# Altium schematic sheet P09 CONNECT & LED.SchDoc
size A2
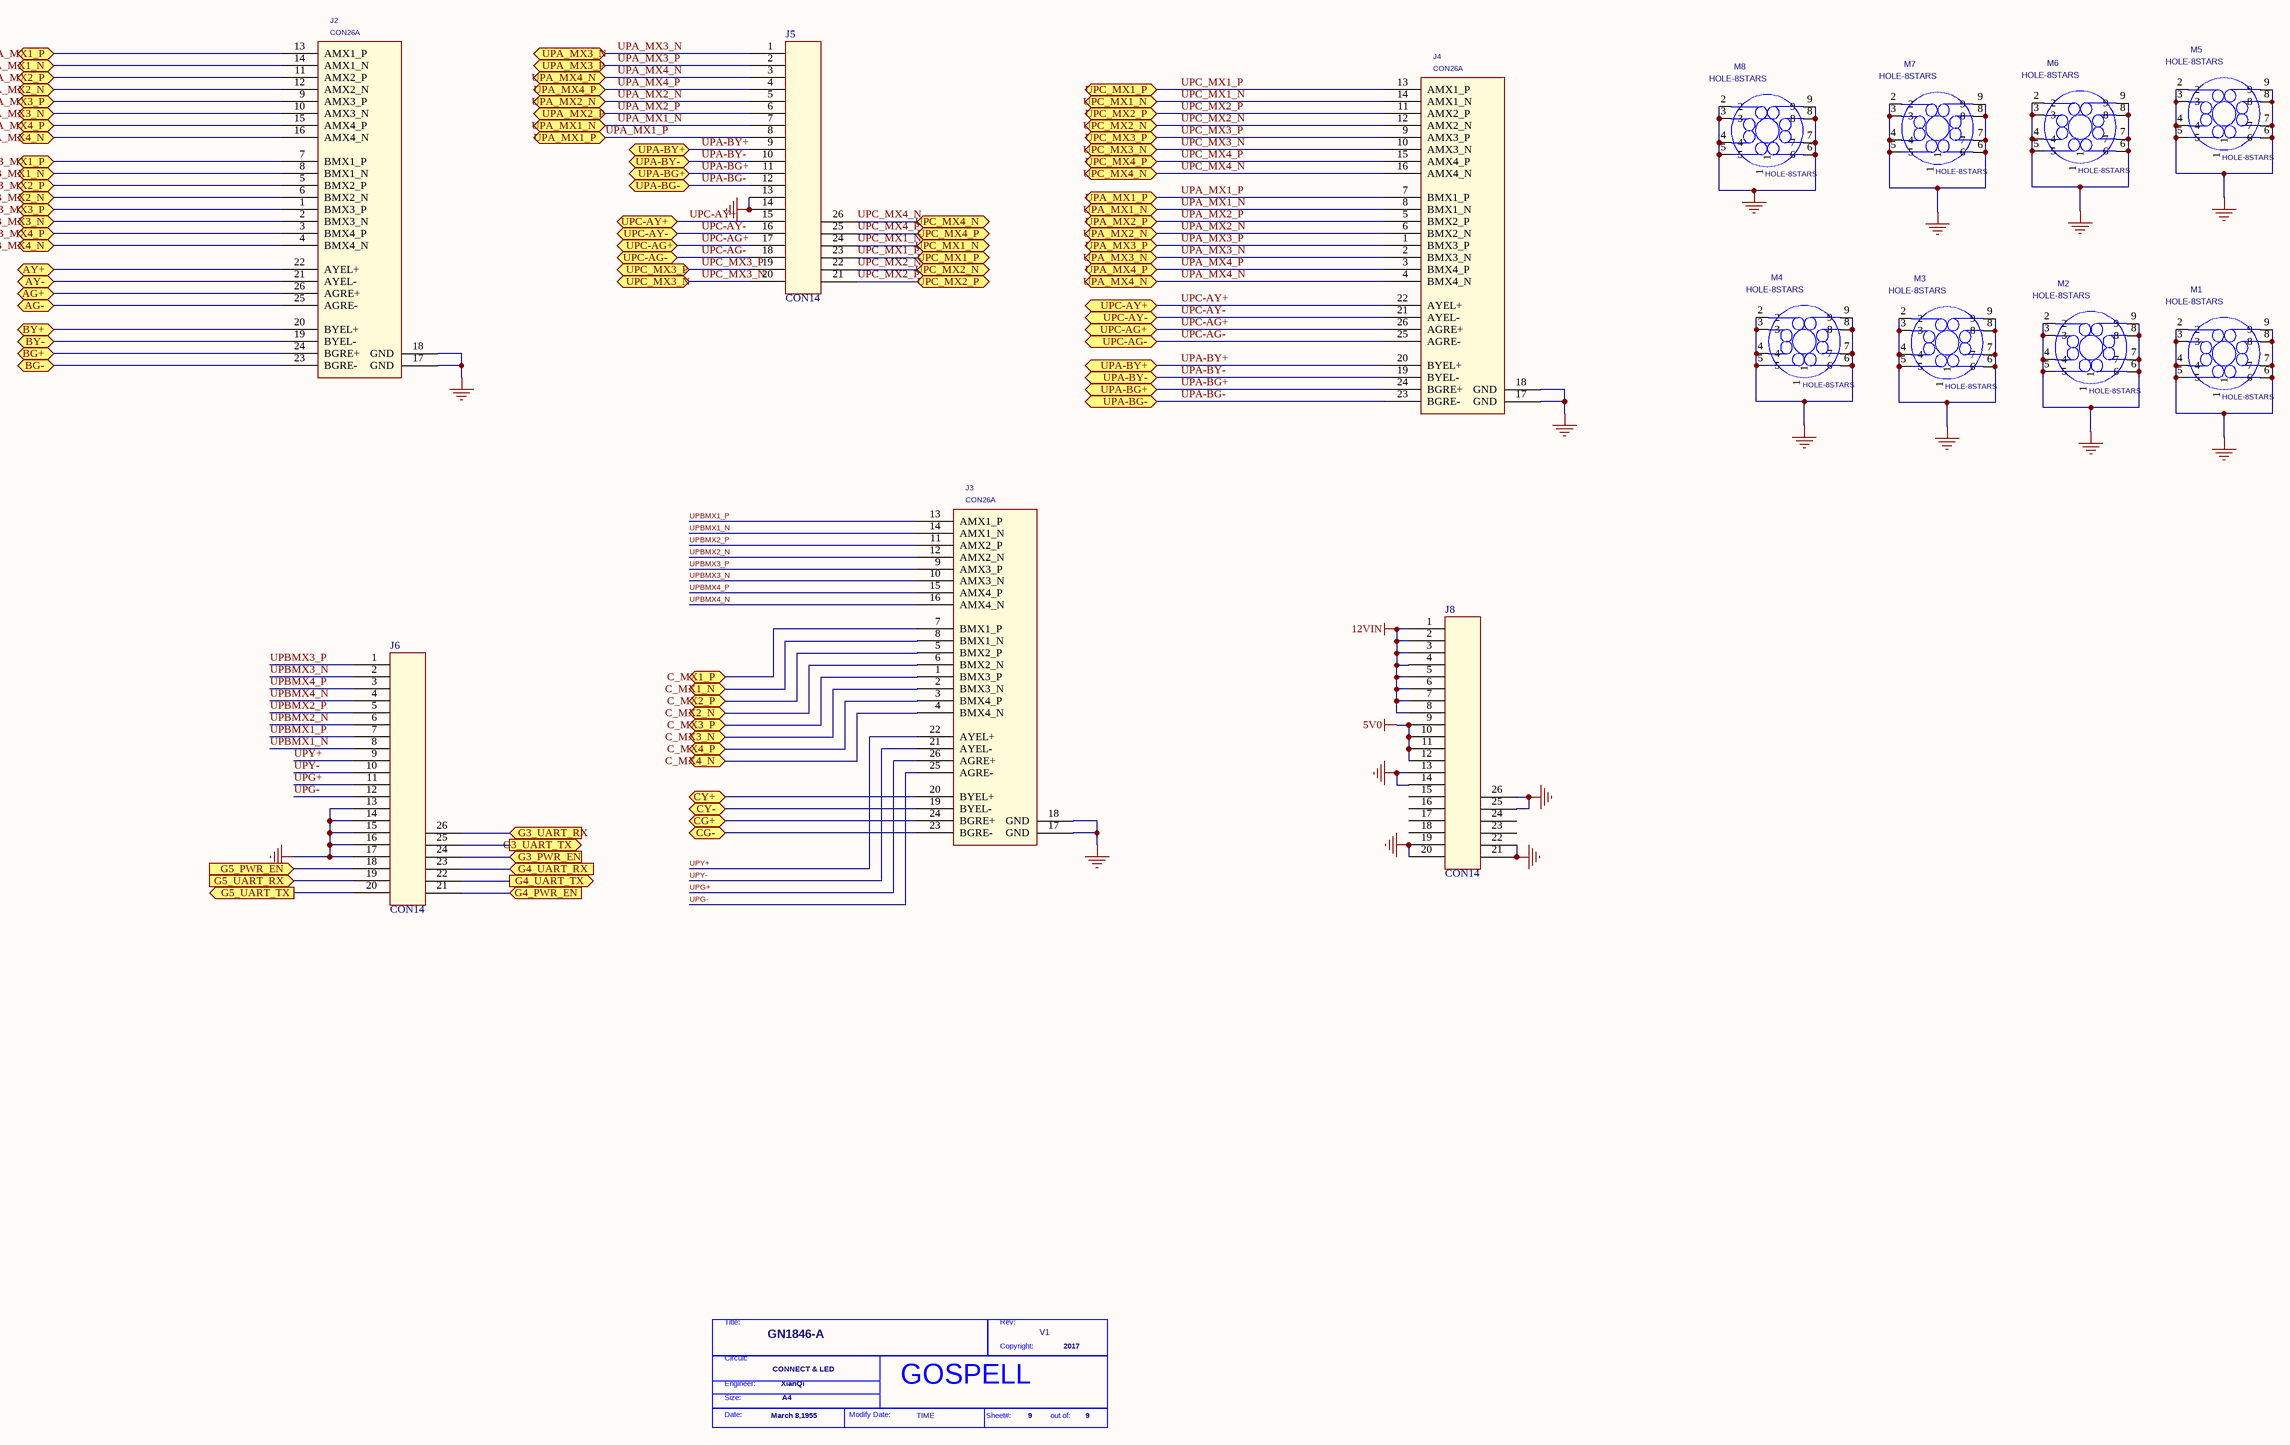
[diagram p0: P09 CONNECT & LED.SchDoc]

## Parts
*  Doc: CONNECT & LED  Page Count: 9  Page Create Date: March 8,1955  Page Size: A4  RevCode: V1  Title: GN1846-A  Copyright: 2017  Engineer: XianQi  Page Modify Date: TIME  (hidden comment: GOSPELL)  (graphical)
J2  CON26A  [HERDER2X13]
J3  CON26A  [HERDER2X13]
J4  CON26A  [HERDER2X13]
J5  CON14  [HERDER13X2-2.0]
J6  CON14  [HERDER13X2-2.0]
J8  CON14  [HERDER13X2-2.0]
M1  HOLE-8STARS  [HK]
M2  HOLE-8STARS  [HK]
M3  HOLE-8STARS  [HK]
M4  HOLE-8STARS  [HK]
M5  HOLE-8STARS  [HK]
M6  HOLE-8STARS  [HK]
M7  HOLE-8STARS  [HK]
M8  HOLE-8STARS  [HK]

## Ports
A_MX1_N (bidir), A_MX1_P (bidir), A_MX2_N (bidir), A_MX2_P (bidir), A_MX3_N (bidir), A_MX3_P (bidir), A_MX4_N (bidir), A_MX4_P (bidir), AG+ (bidir), AG- (bidir), AY+ (bidir), AY- (bidir), B_MX1_N (bidir), B_MX1_P (bidir), B_MX2_N (bidir), B_MX2_P (bidir), B_MX3_N (bidir), B_MX3_P (bidir), B_MX4_N (bidir), B_MX4_P (bidir), BG+ (bidir), BG- (bidir), BY+ (bidir), BY- (bidir), C_MX1_N (bidir), C_MX1_P (bidir), C_MX2_N (bidir), C_MX2_P (bidir), C_MX3_N (bidir), C_MX3_P (bidir), C_MX4_N (bidir), C_MX4_P (bidir), CG+ (bidir), CG- (bidir), CY+ (bidir), CY- (bidir), G3_PWR_EN (in), G3_UART_RX (in), G3_UART_TX (out), G4_PWR_EN (in), G4_UART_RX (in), G4_UART_TX (out), G5_PWR_EN (in), G5_UART_RX (in), G5_UART_TX (out), UPA-BG+ (bidir), UPA-BG- (bidir), UPA-BY+ (bidir), UPA-BY- (bidir), UPA_MX1_N (bidir), UPA_MX1_P (bidir), UPA_MX2_N (bidir), UPA_MX2_P (bidir), UPA_MX3_N (bidir), UPA_MX3_P (bidir), UPA_MX4_N (bidir), UPA_MX4_P (bidir), UPC-AG+ (bidir), UPC-AG- (bidir), UPC-AY+ (bidir), UPC-AY- (bidir), UPC_MX1_N (bidir), UPC_MX1_P (bidir), UPC_MX2_N (bidir), UPC_MX2_P (bidir), UPC_MX3_N (bidir), UPC_MX3_P (bidir), UPC_MX4_N (bidir), UPC_MX4_P (bidir)

## Nets
5V0: J8.9 J8.10 J8.11 J8.12
12VIN: J8.1 J8.2 J8.3 J8.4 J8.5 J8.6 J8.7 J8.8
GND: J2.17(GND) J2.18(GND) J3.17(GND) J3.18(GND) J4.17(GND) J4.18(GND) J5.13 J5.14 J6.13 J6.14 J6.15 J6.16 J6.17 J8.13 J8.14 J8.19 J8.20 J8.21 J8.22 J8.25 J8.26 M1.2 M1.3 M1.4 M1.5 M1.6 M1.7 M1.8 M1.9 M2.2 M2.3 M2.4 M2.5 M2.6 M2.7 M2.8 M2.9 M3.2 M3.3 M3.4 M3.5 M3.6 M3.7 M3.8 M3.9 M4.2 M4.3 M4.4 M4.5 M4.6 M4.7 M4.8 M4.9 M5.2 M5.3 M5.4 M5.5 M5.6 M5.7 M5.8 M5.9 M6.2 M6.3 M6.4 M6.5 M6.6 M6.7 M6.8 M6.9 M7.2 M7.3 M7.4 M7.5 M7.6 M7.7 M7.8 M7.9 M8.2 M8.3 M8.4 M8.5 M8.6 M8.7 M8.8 M8.9
A_MX1_N: J2.14(AMX1_N) ; port A_MX1_N
A_MX1_P: J2.13(AMX1_P) ; port A_MX1_P
A_MX2_N: J2.12(AMX2_N) ; port A_MX2_N
A_MX2_P: J2.11(AMX2_P) ; port A_MX2_P
A_MX3_N: J2.10(AMX3_N) ; port A_MX3_N
A_MX3_P: J2.9(AMX3_P) ; port A_MX3_P
A_MX4_N: J2.16(AMX4_N) ; port A_MX4_N
A_MX4_P: J2.15(AMX4_P) ; port A_MX4_P
AG+: J2.26(AGRE+) ; port AG+
AG-: J2.25(AGRE-) ; port AG-
AY+: J2.22(AYEL+) ; port AY+
AY-: J2.21(AYEL-) ; port AY-
B_MX1_N: J2.8(BMX1_N) ; port B_MX1_N
B_MX1_P: J2.7(BMX1_P) ; port B_MX1_P
B_MX2_N: J2.6(BMX2_N) ; port B_MX2_N
B_MX2_P: J2.5(BMX2_P) ; port B_MX2_P
B_MX3_N: J2.2(BMX3_N) ; port B_MX3_N
B_MX3_P: J2.1(BMX3_P) ; port B_MX3_P
B_MX4_N: J2.4(BMX4_N) ; port B_MX4_N
B_MX4_P: J2.3(BMX4_P) ; port B_MX4_P
BG+: J2.24(BGRE+) ; port BG+
BG-: J2.23(BGRE-) ; port BG-
BY+: J2.20(BYEL+) ; port BY+
BY-: J2.19(BYEL-) ; port BY-
C_MX1_N: J3.8(BMX1_N) ; port C_MX1_N
C_MX1_P: J3.7(BMX1_P) ; port C_MX1_P
C_MX2_N: J3.6(BMX2_N) ; port C_MX2_N
C_MX2_P: J3.5(BMX2_P) ; port C_MX2_P
C_MX3_N: J3.2(BMX3_N) ; port C_MX3_N
C_MX3_P: J3.1(BMX3_P) ; port C_MX3_P
C_MX4_N: J3.4(BMX4_N) ; port C_MX4_N
C_MX4_P: J3.3(BMX4_P) ; port C_MX4_P
CG+: J3.24(BGRE+) ; port CG+
CG-: J3.23(BGRE-) ; port CG-
CY+: J3.20(BYEL+) ; port CY+
CY-: J3.19(BYEL-) ; port CY-
G3_PWR_EN: J6.24 ; port G3_PWR_EN
G3_UART_RX: J6.26 ; port G3_UART_RX
G3_UART_TX: J6.25 ; port G3_UART_TX
G4_PWR_EN: J6.21 ; port G4_PWR_EN
G4_UART_RX: J6.23 ; port G4_UART_RX
G4_UART_TX: J6.22 ; port G4_UART_TX
G5_PWR_EN: J6.18 ; port G5_PWR_EN
G5_UART_RX: J6.19 ; port G5_UART_RX
G5_UART_TX: J6.20 ; port G5_UART_TX
UPA-BG+: J4.24(BGRE+) J5.11 ; port UPA-BG+
UPA-BG-: J4.23(BGRE-) J5.12 ; port UPA-BG-
UPA-BY+: J4.20(BYEL+) J5.9 ; port UPA-BY+
UPA-BY-: J4.19(BYEL-) J5.10 ; port UPA-BY-
UPA_MX1_N: J4.8(BMX1_N) J5.7 ; port UPA_MX1_N
UPA_MX1_P: J4.7(BMX1_P) J5.8 ; port UPA_MX1_P
UPA_MX2_N: J4.6(BMX2_N) J5.5 ; port UPA_MX2_N
UPA_MX2_P: J4.5(BMX2_P) J5.6 ; port UPA_MX2_P
UPA_MX3_N: J4.2(BMX3_N) J5.1 ; port UPA_MX3_N
UPA_MX3_P: J4.1(BMX3_P) J5.2 ; port UPA_MX3_P
UPA_MX4_N: J4.4(BMX4_N) J5.3 ; port UPA_MX4_N
UPA_MX4_P: J4.3(BMX4_P) J5.4 ; port UPA_MX4_P
UPBMX1_N: J3.14(AMX1_N) J6.8
UPBMX1_P: J3.13(AMX1_P) J6.7
UPBMX2_N: J3.12(AMX2_N) J6.6
UPBMX2_P: J3.11(AMX2_P) J6.5
UPBMX3_N: J3.10(AMX3_N) J6.2
UPBMX3_P: J3.9(AMX3_P) J6.1
UPBMX4_N: J3.16(AMX4_N) J6.4
UPBMX4_P: J3.15(AMX4_P) J6.3
UPC-AG+: J4.26(AGRE+) J5.17 ; port UPC-AG+
UPC-AG-: J4.25(AGRE-) J5.18 ; port UPC-AG-
UPC-AY+: J4.22(AYEL+) J5.15 ; port UPC-AY+
UPC-AY-: J4.21(AYEL-) J5.16 ; port UPC-AY-
UPC_MX1_N: J4.14(AMX1_N) J5.24 ; port UPC_MX1_N
UPC_MX1_P: J4.13(AMX1_P) J5.23 ; port UPC_MX1_P
UPC_MX2_N: J4.12(AMX2_N) J5.22 ; port UPC_MX2_N
UPC_MX2_P: J4.11(AMX2_P) J5.21 ; port UPC_MX2_P
UPC_MX3_N: J4.10(AMX3_N) J5.20 ; port UPC_MX3_N
UPC_MX3_P: J4.9(AMX3_P) J5.19 ; port UPC_MX3_P
UPC_MX4_N: J4.16(AMX4_N) J5.26 ; port UPC_MX4_N
UPC_MX4_P: J4.15(AMX4_P) J5.25 ; port UPC_MX4_P
UPG+: J3.26(AGRE+) J6.11
UPG-: J3.25(AGRE-) J6.12
UPY+: J3.22(AYEL+) J6.9
UPY-: J3.21(AYEL-) J6.10

Not connected (* = marked no-connect by the designer): J8 15(14) 16(14) 17(14) 18(14) 23(14) 24(14); M1 1; M2 1; M3 1; M4 1; M5 1; M6 1; M7 1; M8 1

## Notes on the sheet
- (in symbol GOSPELL) Title:; Rev:; Copyright:; Circuit:; Engineer:; Size:; Date:; Modify Date:; Sheet#:; out of:

## Library data of the parts
J2-J4 = CON26A_0
M1-M8 = GEN35: Layer: Top; SMD: No; DEVICE: HOLE-8STARS
* = GOSPELL: Page Number: 9; Cage Code: 2017; Schematic Page Count: 9; Schematic Page Number: 9